# Altium schematic sheet Stm32F411CEU6_Property.SchDoc
size A; SheetNumber: 10; SheetTotal: 12
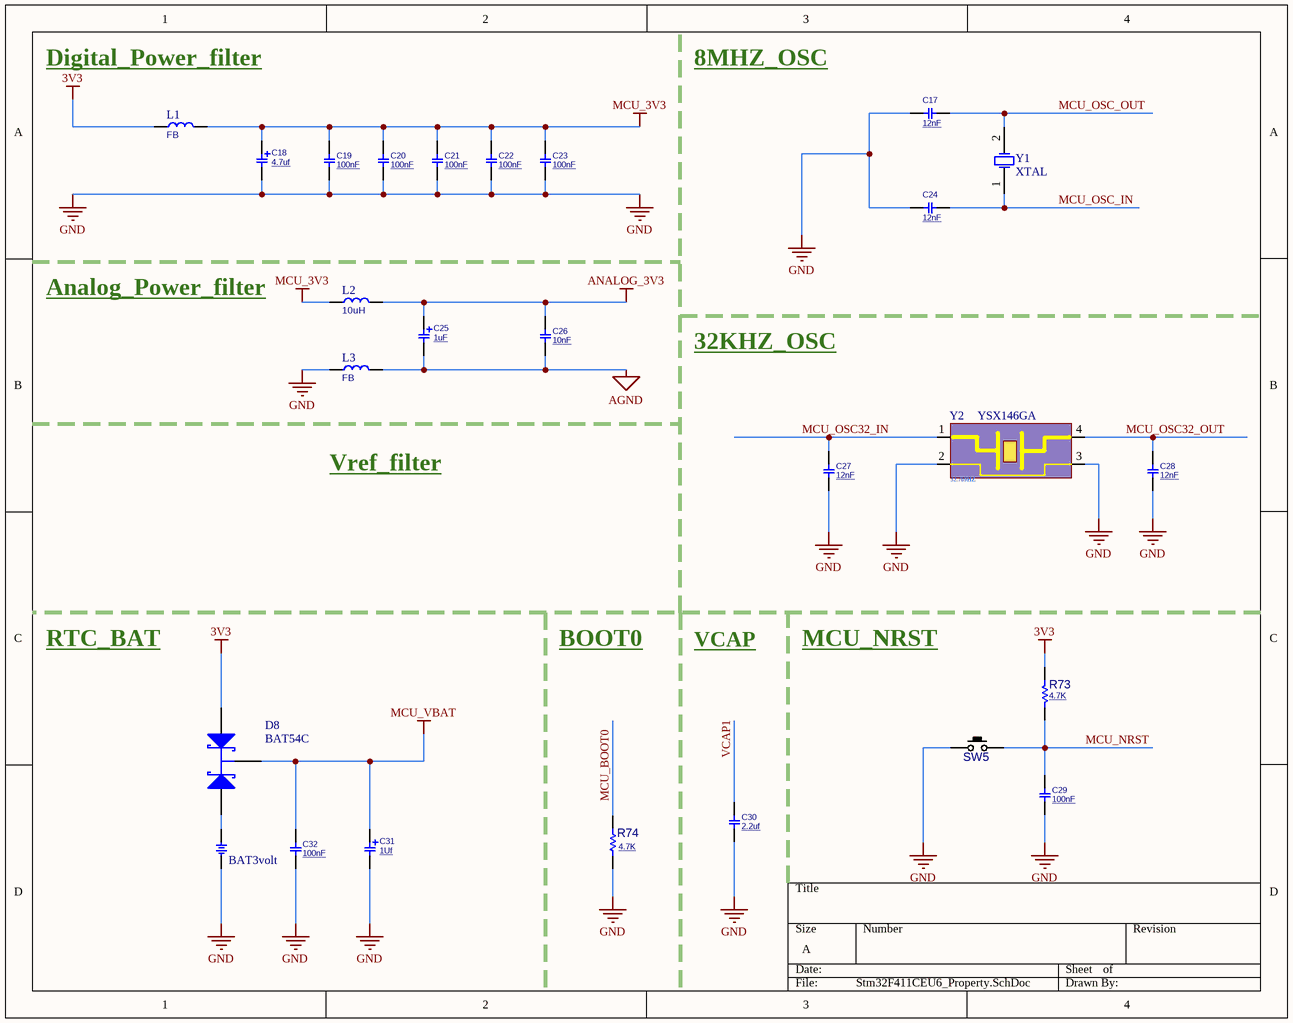
[diagram p0: Stm32F411CEU6_Property.SchDoc]

## Parts
BT1  BAT3volt  [BTH1220]
C17  12nF  [C0603]
C18  4.7uF  [C_TN_3216]
C19  100nF  [C0603]
C20  100nF  [C0603]
C21  100nF  [C0603]
C22  100nF  [C0603]
C23  100nF  [C0603]
C24  12nF  [C0603]
C25  value 1uF  [C_TN_3216]  (hidden comment: 4.7uF)
C26  10nF  [C0603]
C27  12nF  [C0603]
C28  12nF  [C0603]
C29  100nF  [C0603]
C30  2.2uf  [C0603]
C31  value 1Uf  [C_TN_3216]  (hidden comment: 4.7uF)
C32  100nF  [C0603]
D8  BAT54C  [NXP-SOT23-3_V]
L1  FB  [L0805]
L2  10uH  [L1210A]
L3  FB  [L0805]
R73  4.7K  [R0603]
R74  4.7K  [R0603]
SW5  PUSHBUTTON  [SWPBS_SPST_6X3X5]  (value not drawn)
Y1  XTAL  [XTL_2_5032]
Y2  YSX146GA  [YSX146GA-32.768xTAL]

## Nets
3V3: D8.1(A) L1.1 R73.2
AGND: C25.2 C26.1 L3.2
ANALOG_3V3: C25.1 C26.2 L2.2
GND: BT1.2 C17.2 C18.2 C19.1 C20.1 C21.1 C22.1 C23.1 C24.2 C27.2 C28.2 C29.1 C30.1 C31.2 C32.1 L3.1 R74.1 SW5.1(P1) Y2.2 Y2.3
MCU_3V3: C18.1 C19.2 C20.2 C21.2 C22.2 C23.2 L1.2 L2.1
MCU_VBAT: C31.1 C32.2 D8.3(K)
MCU_BOOT0: R74.2
MCU_NRST: C29.2 R73.1 SW5.2(P3)
MCU_OSC32_IN: C27.1 Y2.1
MCU_OSC32_OUT: C28.1 Y2.4
MCU_OSC_IN: C24.1 Y1.1(OSC1)
MCU_OSC_OUT: C17.1 Y1.2(OSC2)
VCAP1: C30.2
NetBT1_1: BT1.1 D8.2(A)

## Notes on the sheet
- Digital_Power_filter
- 8MHZ_OSC
- Analog_Power_filter
- 32KHZ_OSC
- Vref_filter
- RTC_BAT
- BOOT0
- VCAP
- MCU_NRST
- (in symbol YSX146GA) 32.769HZ

## Library data of the parts
BT1 = BATH_CR1220: BATTERY HOLDER, CR1220; MANF_P#: -; .: http://www.chila.ir; VALUE: BAT3volt
C17 C19-C24 C26-C30 C32 = CAP_SMD_MLCC_0603: CAP, MLCC, -F, -V, MATERIAL, -%, 0201; PARAM: -, -%; MANF_P#: MANF_PART#; PRICE: 100= 1$; MANF: -; PARAM2: -V; ASSEMBLY: ASSEMBLY
  C17 C24 C27 C28: VALUE: 12nF
  C19-C23 C29 C32: VALUE: 100nF
  C26: VALUE: 10nF
  C30: VALUE: 2.2uf
C18 C25 C31 = CAP_SMD_TAN_3216: CAP, SMD, TAN,; PARAM2: -V
  C18: VALUE: 4.7uf
D8 = CMP-0417-00003-1: Schottky Barrier Diode, 30 V, 2 uA, -55 to 150 degC, 3-Pin SOT23, RoHS, Tape and Reel; Manufacturer: NXP Semiconductors; IR (uA): 2; VF (mV): 800; Trr (ns): 5; Cd (pF): 10; VR (V): 30; Rth(j-a) (K/W): 500; RoHS: TRUE; Packing: Tape and Reel; ComponentLink2URL: http://www.nxp.com/documents/data_sheet/BAT54_SER.pdf; PartNumber: BAT54C; ComponentLink2Description: Datasheet; Temperature Range: -55 to 150 degC; PackageReference: SOT23-3; PackageDescription: 3-Pin Plastic Surface-mounted Package, Body 1.3 x 2.9 mm, Pitch 0.95 mm; Mounting Technology: Surface Mount; ComponentLink1URL: http://www.nxp.com/; DatasheetVersion: Rev. 5; ComponentLink1Description: Manufacturer URL
L1-L3 = IND_SMD: INDUCTOR, SMD
  L1 L3: VALUE: FB
  L2: VALUE: 10uH
R73 R74 = RES_SMD: RESISTOR, SMD; PARAM: -W; DESC: DESCRIPTION; DIST#: MOUSER; PARAM2: 1%; MANF_P#: -; MANF: -; ASSEMBLY: ASSEMBLY; PRICE: 100= 0.5$; VALUE: 4.7K
SW5 = SWPBS_SPST_6X3X5: SWITCH, PUSH BUTTON, TACTILE, SMD, SPST, 6X3.5X5mm; MANF: ALPS; DESC: DESCRIPTION; MANF_P#: SKQMBBE010; VALUE: PUSHBUTTON; ASSEMBLY: ASSEMBLY; PARAM: PARAM; PRICE: PRICE
Y1 = XTAL: Crystal Oscillator; Published: 8-Jun-2000; LatestRevisionDate: 17-Jul-2002; LatestRevisionNote: Re-released for DXP Platform.; PackageReference: R38; Publisher: Altium Limited; PackageDescription: Crystal, Thru-Hole; 2 Leads; Body 3.1 x 8.2 mm (Dia.xH)